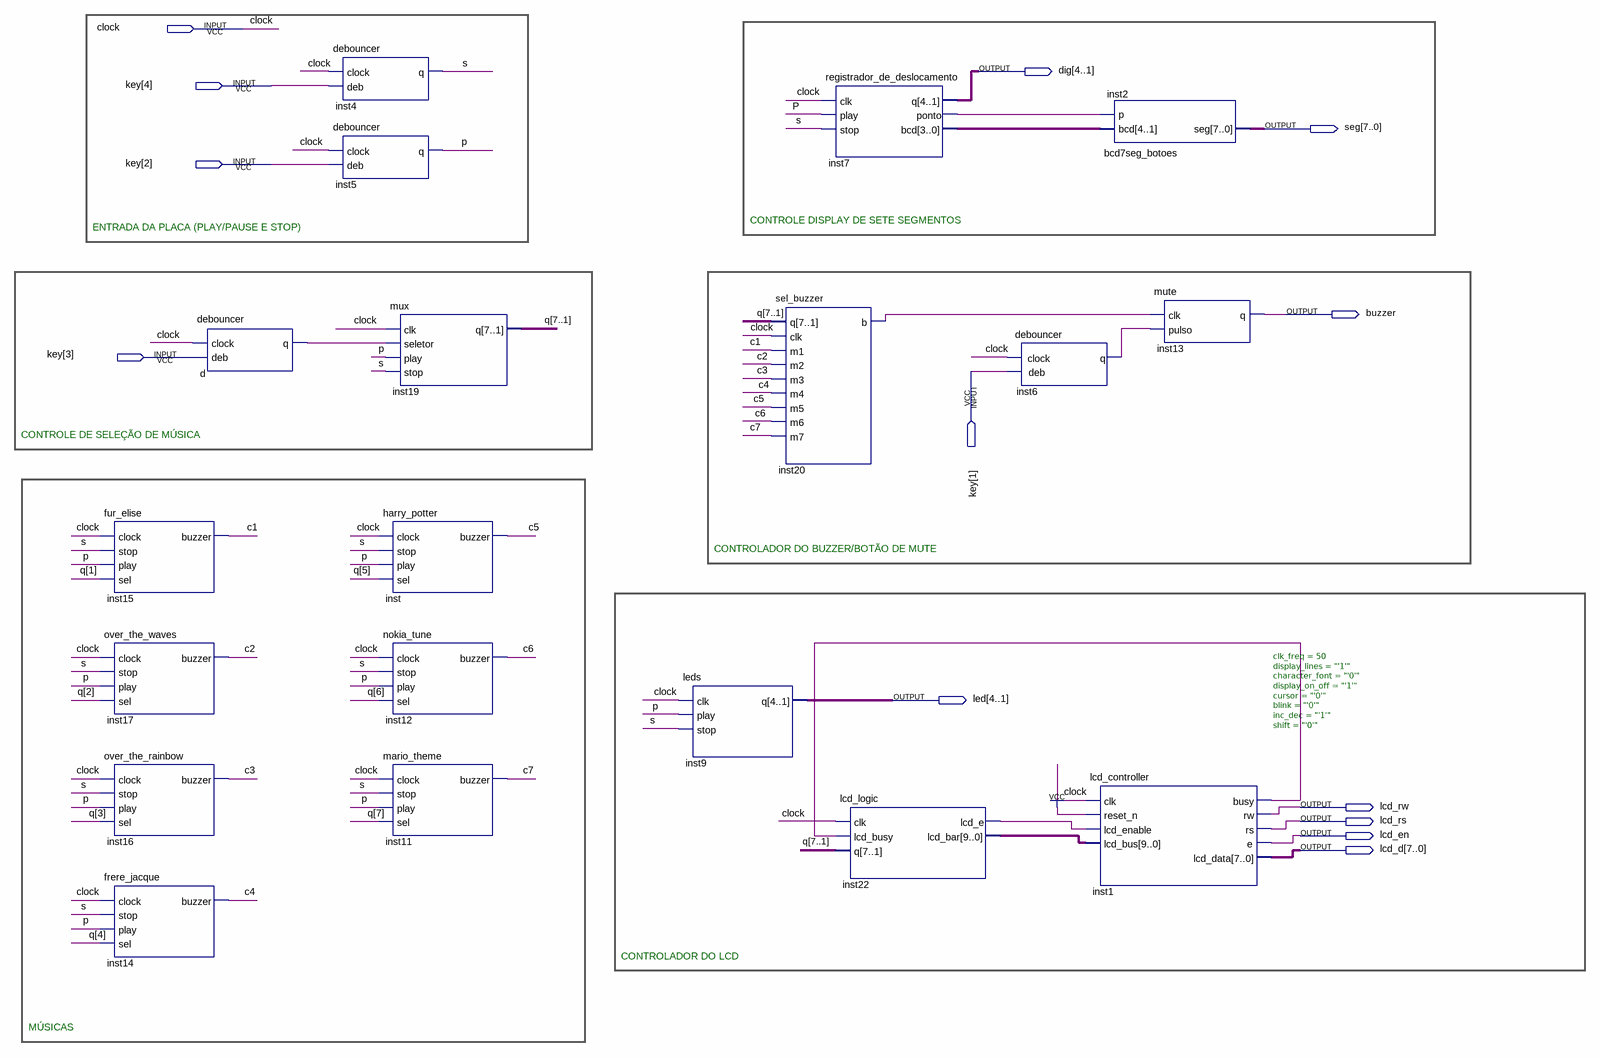
[diagram p0: schematic sheet]
// Quartus schematic Projeto_3.bdf as structural Verilog: 19 symbols, 13 pins
module Projeto_3 (
  input  clock,
  input  [4:1] key,
  output [4:1] dig,
  output [7:0] seg,
  output buzzer,
  output [4:1] led,
  output lcd_rw,
  output lcd_rs,
  output lcd_en,
  output [7:0] lcd_d
);

  wire c1, c2, c3, c4, c5, c6, c7, d_q, inst1_busy, inst6_q, inst7_ponto, inst20_b, inst22_lcd_e, p, s;
  wire [3:0] inst7_bcd;
  wire [7:1] q;
  wire [9:0] inst22_lcd_bar;

  fur_elise inst15 (.clock(clock), .stop(s), .play(p), .sel(q[1]), .buzzer(c1));
  over_the_waves inst17 (.clock(clock), .stop(s), .play(p), .sel(q[2]), .buzzer(c2));
  over_the_rainbow inst16 (.clock(clock), .stop(s), .play(p), .sel(q[3]), .buzzer(c3));
  frere_jacque inst14 (.clock(clock), .stop(s), .play(p), .sel(q[4]), .buzzer(c4));
  debouncer d (.clock(clock), .deb(key[3]), .q(d_q));
  debouncer inst4 (.clock(clock), .deb(key[4]), .q(s));
  debouncer inst5 (.clock(clock), .deb(key[2]), .q(p));
  mux inst19 (.clk(clock), .seletor(d_q), .play(p), .stop(s), .q(q));
  harry_potter inst (.clock(clock), .stop(s), .play(p), .sel(q[5]), .buzzer(c5));
  nokia_tune inst12 (.clock(clock), .stop(s), .play(p), .sel(q[6]), .buzzer(c6));
  mario_theme inst11 (.clock(clock), .stop(s), .play(p), .sel(q[7]), .buzzer(c7));
  leds inst9 (.clk(clock), .play(p), .stop(s), .q(led));
  sel_buzzer inst20 (.q(q), .clk(clock), .m1(c1), .m2(c2), .m3(c3), .m4(c4), .m5(c5), .m6(c6), .m7(c7), .b(inst20_b));
  registrador_de_deslocamento inst7 (.clk(clock), .play(p), .stop(s), .q(dig), .ponto(inst7_ponto), .bcd(inst7_bcd));
  lcd_logic inst22 (.clk(clock), .lcd_busy(inst1_busy), .q(q), .lcd_e(inst22_lcd_e), .lcd_bar(inst22_lcd_bar));
  debouncer inst6 (.clock(clock), .deb(key[1]), .q(inst6_q));
  bcd7seg_botoes inst2 (.bcd(inst7_bcd), .p(inst7_ponto), .seg(seg));
  lcd_controller #(.clk_freq(50), .display_lines("'1'"), .character_font("'0'"), .display_on_off("'1'"), .cursor("'0'"), .blink("'0'"), .inc_dec("'1'"), .shift("'0'")) inst1 (
    .clk(clock), .reset_n(1'b1), .lcd_enable(inst22_lcd_e), .lcd_bus(inst22_lcd_bar), .busy(inst1_busy),
    .rw(lcd_rw), .rs(lcd_rs), .e(lcd_en), .lcd_data(lcd_d));
  mute inst13 (.clk(inst20_b), .pulso(inst6_q), .q(buzzer));

  // Notes on the sheet:
  //   CONTROLE DISPLAY DE SETE SEGMENTOS
  //   ENTRADA DA PLACA (PLAY/PAUSE E STOP)
  //   CONTROLE DE SELEÇÃO DE MÚSICA
  //   CONTROLADOR DO BUZZER/BOTÃO DE MUTE
  //   CONTROLADOR DO LCD
  //   MÚSICAS
endmodule
